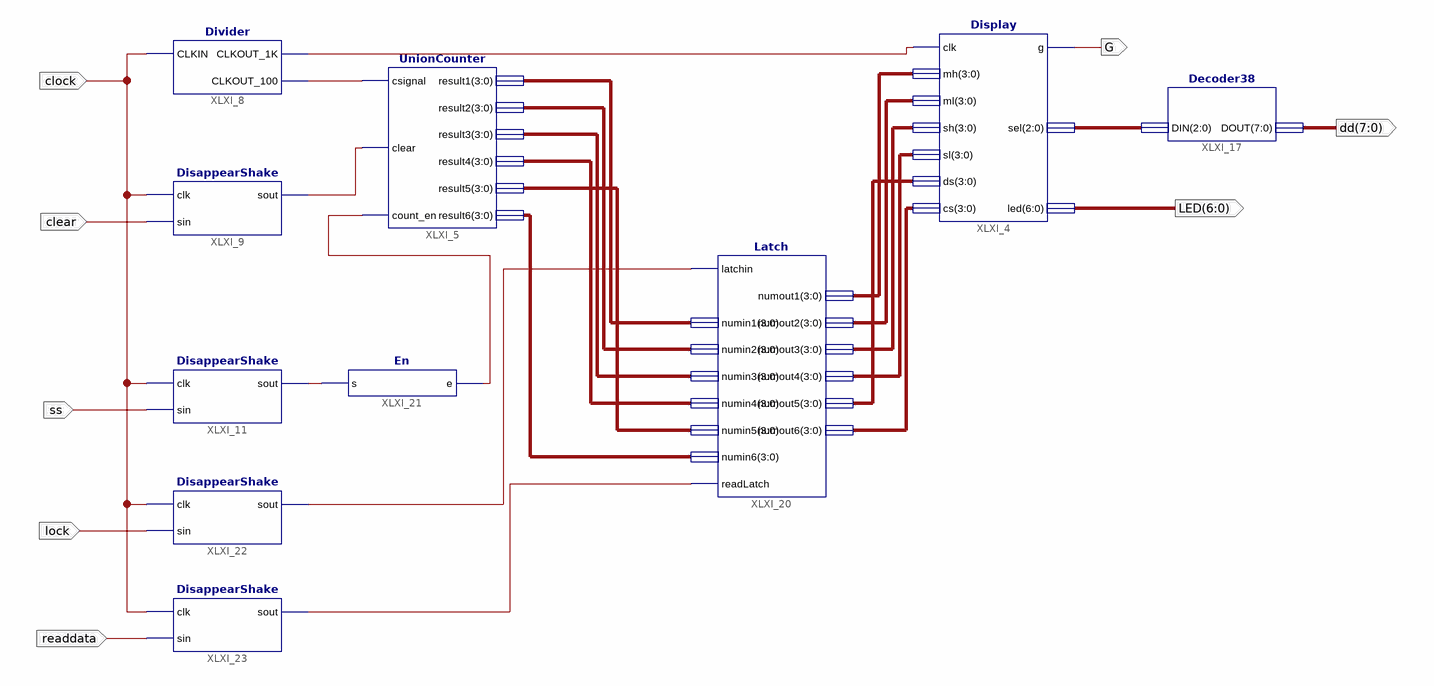
[diagram p0: schematic sheet 1]
// Xilinx ISE schematic DigitalClock.sch (spartan3a) as structural Verilog: 10 symbols, 8 ports
module DigitalClock (
  input  clock,
  input  clear,
  input  ss,
  input  lock,
  input  readdata,
  output G,
  output [6:0] LED,
  output [7:0] dd
);

  wire XLXN_78, XLXN_146, XLXN_305, XLXN_308, XLXN_309, XLXN_346, XLXN_349;
  wire [2:0] SEL;
  wire [3:0] XLXN_219, XLXN_220, XLXN_222, XLXN_224, XLXN_225, XLXN_226, XLXN_227, XLXN_228, XLXN_229,
       XLXN_230, XLXN_231, XLXN_232;

  Decoder38 XLXI_17 (.DIN(SEL), .DOUT(dd));
  Display XLXI_4 (
    .clk(XLXN_146), .mh(XLXN_227), .ml(XLXN_228), .sh(XLXN_229), .sl(XLXN_230), .ds(XLXN_231), .cs(XLXN_232),
    .g(G), .sel(SEL), .led(LED));
  Divider XLXI_8 (.CLKIN(clock), .CLKOUT_1K(XLXN_146), .CLKOUT_100(XLXN_305));
  DisappearShake XLXI_9 (.clk(clock), .sin(clear), .sout(XLXN_78));
  DisappearShake XLXI_11 (.clk(clock), .sin(ss), .sout(XLXN_308));
  UnionCounter XLXI_5 (
    .csignal(XLXN_305), .clear(XLXN_78), .count_en(XLXN_309), .result1(XLXN_219), .result2(XLXN_220),
    .result3(XLXN_222), .result4(XLXN_224), .result5(XLXN_225), .result6(XLXN_226));
  Latch XLXI_20 (
    .latchin(XLXN_346), .readLatch(XLXN_349), .numin1(XLXN_219), .numin2(XLXN_220), .numin3(XLXN_222),
    .numin4(XLXN_224), .numin5(XLXN_225), .numin6(XLXN_226), .numout1(XLXN_227), .numout2(XLXN_228),
    .numout3(XLXN_229), .numout4(XLXN_230), .numout5(XLXN_231), .numout6(XLXN_232));
  En XLXI_21 (.s(XLXN_308), .e(XLXN_309));
  DisappearShake XLXI_22 (.clk(clock), .sin(lock), .sout(XLXN_346));
  DisappearShake XLXI_23 (.clk(clock), .sin(readdata), .sout(XLXN_349));
endmodule
